# Altium project Common_HVSUP_ISOL_6W.PrjPCB (part 5 of 5)

## Sheet Supply_HV_ISOL.SchDoc: HVPSU_ISOL
size 420 x 297 mm; EDA_Number: ARTIQ; Projet: HVPSU_ISOL; Author: G.Kasprowicz; CompanyName: WUT ISE; DrawnBy: G.Kasprowicz; Organization: WUT ISE; Address1: PW ISE; Address2: Nowowiejska 15/19 00-665 Warsaw; Address3: gkasprow@gmail.com; DocumentNumber: 2; Revision: 1.0; SheetNumber: 2; SheetTotal: 4; ModifiedBy: -; CheckedDate: -; Title2: Supply HV ISOL; DivGrp: WUT ISE; Designer: G.Kasprowicz; ModifiedDate: -; ProjectName: Sensor Box
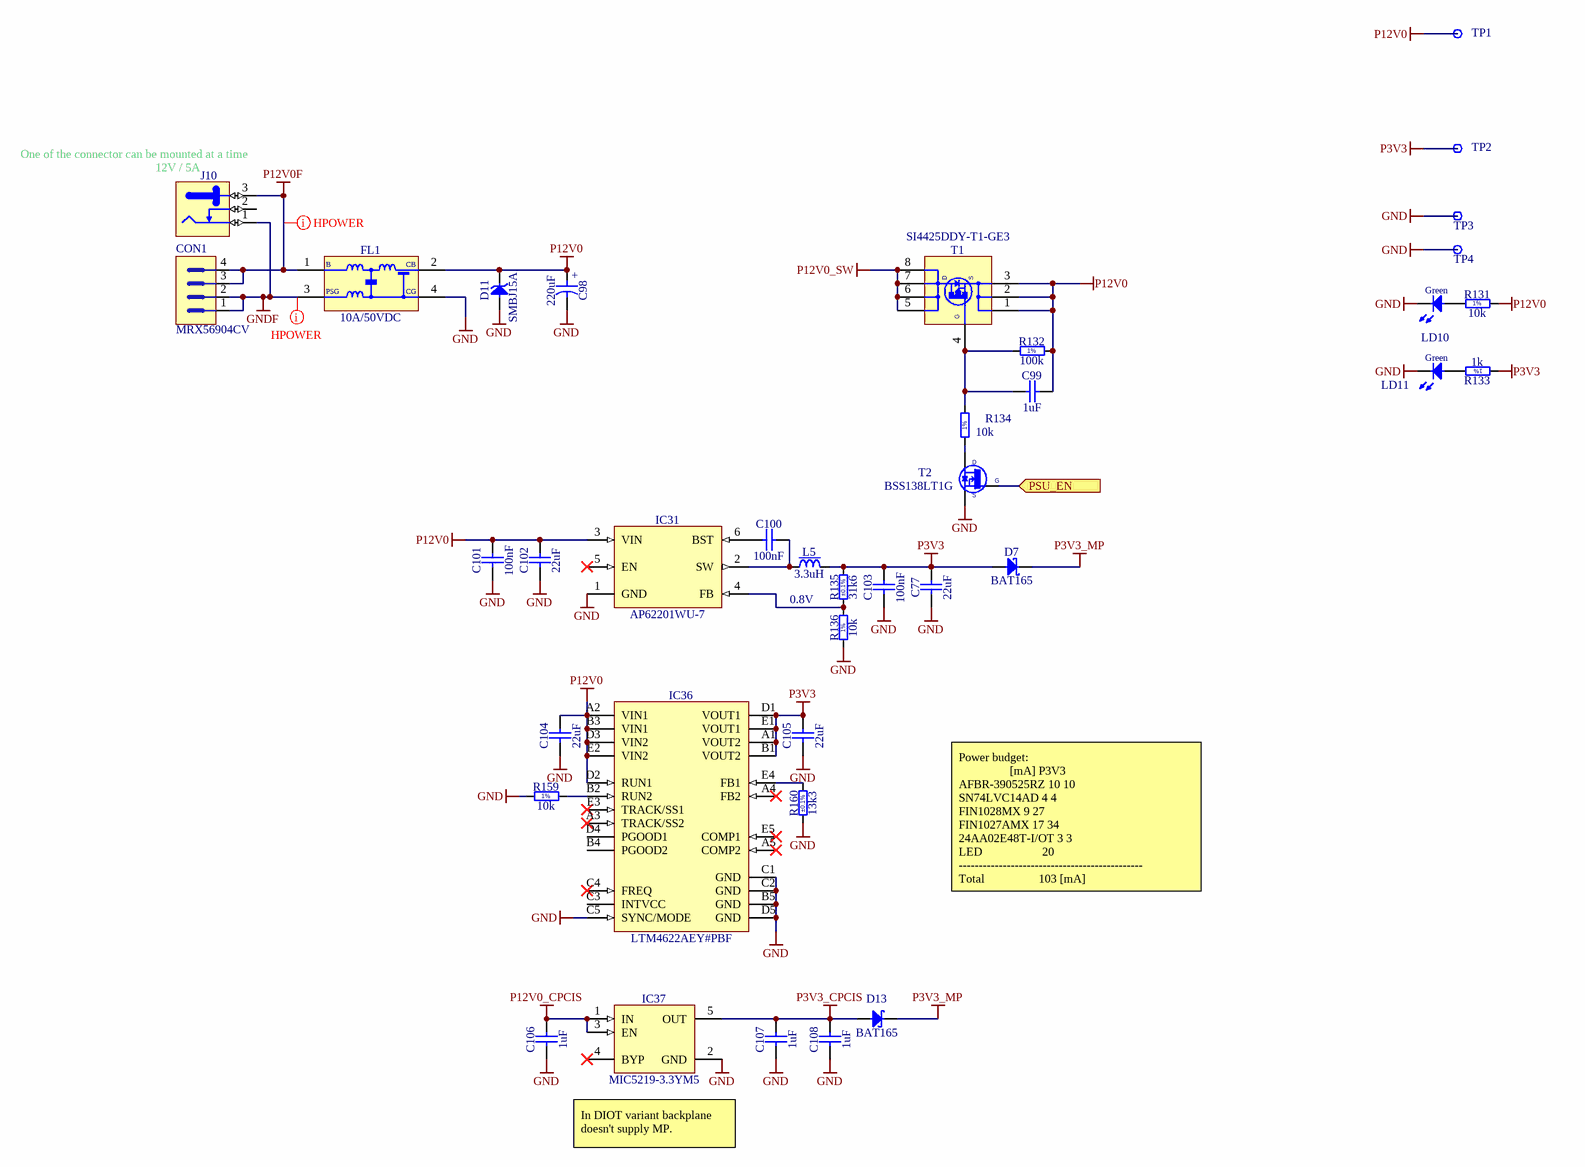
[diagram p9: Supply_HV_ISOL.SchDoc]

### Parts
C77  22uF  [CAPC2012X135N]
C98  220uF  [CAPAE830X620N]
C99  1uF  [CAPC1005X55N]
C100  100nF  [CAPC1005X55N]
C101  100nF  [CAPC1005X55N]
C102  22uF  [CAPC2012X135N]
C103  100nF  [CAPC1005X55N]
C104  22uF  [CAPC2012X135N]
C105  22uF  [CAPC2012X135N]
C106  1uF  [CAPC1608X87N]
C107  1uF  [CAPC1005X55N]
C108  1uF  [CAPC1005X55N]
CON1  MRX56904CV  [MRX56904CV]
D7  BAT165  [SOD2512X110N]
D11  SMBJ15A  [DIOM5336X265N]
D13  BAT165  [SOD2512X110N]
FL1  10A/50VDC  [FIL_MURATA_BNX02]
IC31  AP62201WU-7  [SOT95P280X100-6N]
IC36  LTM4622AEY#PBF  [BGA25C127P5X5_625X625X262]
IC37  MIC5219-3.3YM5  [SOT95P280X145-5N]
J10  Jack  [SWITCHCRAFT_L712RA]  (value not drawn)
L5  3.3uH  [IND_WURTH_WE-TPC_4828]
LD10  Green  [LED_KINGBRIGHT_KPH-1608CGCK]
LD11  Green  [LED_KINGBRIGHT_KPH-1608CGCK]
R131  10k  [RESC1005X40N]
R132  100k  [RESC1608X55N]
R133  1k  [RESC1608X55N]
R134  10k  [RESC1005X40N]
R135  31k6  Tolerance: ±0.1%  [RESC1005X35N]
R136  10k  [RESC1005X40N]
R159  10k  [RESC1005X40N]
R160  13k3  Tolerance: ±0.1%  [RESC1608X55N]
T1  SI4425DDY-T1-GE3  [SOIC127P600X175-8N]
T2  BSS138LT1G  [SOT95P240X110-3N]
TP1  Test Point  [TPS127]  (value not drawn)  (no BOM)
TP2  Test Point  [TPS127]  (value not drawn)  (no BOM)
TP3  Test Point  [TPS127]  (value not drawn)  (no BOM)
TP4  Test Point  [TPS127]  (value not drawn)  (no BOM)

### Ports
PSU_EN (in)

### Nets
GND: C77.1 C98.2 C101.1 C102.1 C103.1 C104.1 C105.1 C106.1 C107.1 C108.1 D11.2(A) FL1.4(CG) IC31.1(GND) IC36.B5(GND) IC36.C1(GND) IC36.C2(GND) IC36.C5(SYNC/MODE) IC36.D5(GND) IC37.2(GND) LD10.1(C) LD11.1(C) R136.1 R159.1 R160.1 T2.2(S) TP3.1 TP4.1
GNDF: CON1.1 CON1.2 FL1.3(PSG) J10.1
P3V3: C77.2 C103.2 C105.2 D7.2(A) IC36.A1(VOUT2) IC36.B1(VOUT2) IC36.D1(VOUT1) IC36.E1(VOUT1) L5.2 R133.1 R135.2 TP2.1
P3V3_CPCIS: C107.2 C108.2 D13.2(A) IC37.5(OUT)
P3V3_MP: D7.1(C) D13.1(C)
P12V0: C98.1 C99.2 C101.2 C102.2 C104.2 D11.1(C) FL1.2(CB) IC31.3(VIN) IC36.A2(VIN1) IC36.B3(VIN1) IC36.D2(RUN1) IC36.D3(VIN2) IC36.E2(VIN2) R131.2 R132.2 T1.1(S) T1.2(S) T1.3(S) TP1.1
P12V0_CPCIS: C106.2 IC37.1(IN) IC37.3(EN)
P12V0_SW: T1.5(D) T1.6(D) T1.7(D) T1.8(D)
P12V0F: CON1.3 CON1.4 FL1.1(B) J10.3
PSU_EN: T2.1(G) ; port PSU_EN
NetC99_1: C99.1 R132.1 R134.2 T1.4(S)
NetC100_1: C100.1 IC31.6(BST)
NetC100_2: C100.2 IC31.2(SW) L5.1
NetIC31_4: IC31.4(FB) R135.1 R136.2
NetIC36_B2: IC36.B2(RUN2) R159.2
NetIC36_E4: IC36.E4(FB1) R160.2
NetLD10_2: LD10.2(A) R131.1
NetLD11_2: LD11.2(A) R133.2
NetR134_1: R134.1 T2.3(D)

Not connected (* = marked no-connect by the designer): IC31 5(EN)*; IC36 A3(TRACK/SS2)* A4(FB2)* A5(COMP2)* B4(PGOOD2) C3(INTVCC) C4(FREQ)* D4(PGOOD1) E3(TRACK/SS1)* E5(COMP1)*; IC37 4(BYP)*; J10 2

### Layout directives
net class Hpower; rule Routing Via Style [Pref Size = 0.7mm    Pref Hole Size = 0.5mm]; rule Width Constraint [Pref Width = 20mil    Min Width = 15mil    Max Width = 50mil]: GNDF, P12V0F

### Notes on the sheet
- (near J10) One of the connector can be mounted at a time
- (near J10) 12V / 5A
- 0.8V
- Power budget:
  [mA]	P3V3
  AFBR-390525RZ	10	10
  SN74LVC14AD	4	4
  FIN1028MX	9	27
  FIN1027AMX	17	34
  24AA02E48T-I/OT	3	3
  LED		                  20
  ----------------------------------------------
  Total		                103 [mA]
- In DIOT variant backplane doesn't supply MP.
- Project/Equipment
- Document
- Designer
- Drawn by
- Check.by
- Copyright WUT ISE 2020.
  This documentation describes Open Hardware and is licensed under the CERN OHL v.1.2. You may redistribute and modify this documentation under the terms of the CERN OHL v.1.2. (http://ohwr.org/CERNOHL). This documentation is distributed WITHOUT ANY EXPRESS OR IMPLIED WARRANTY, INCLUDING OF MERCHANTABILITY, SATISFACTORY QUALITY AND FITNESS FOR A PARTICULAR PURPOSE. Please see the CERN OHL v.1.2 for applicable conditions.
- Contact
- File
- Last Mod.
- Print Date
- Sheet
- Size
- A3
- of
- Rev
- (in symbol CAE830-620_220UF_16V_20%) +
- (in symbol R0402_10K_1%_0.0625W_100PPM) 1%
- (in symbol R0603_1K_1%_0.1W_100PPM) 1%
- (in symbol R0603_100K_1%_0.1W_100PPM) 1%
- (in symbol SI4425DDY-T1-GE3) G

### Library data of the parts
C77 C102 C104 C105 = CC0805_22UF_16V_10%_X5R: Non-polarised capacitor; Part Description: SMD Multilayer Chip Ceramic Capacitor; Manufacturer: GENERIC; Manufacturer1 Part Number: C2012X5R1C226KT; Voltage: 16V; TC: X5R; Tolerance: ±10%; Part Number: CC0805_22UF_16V_10%_X5R; Component Kind: Standard; Component Type: Standard; Pin Count: 2; Value: 22uF; Status: Preferred; Manufacturer Part Number: CC0805_22UF_16V_10%_X5R; Case: 0805; Mounted: Yes; Socket: No; SMD: Yes; Sense: No; Manufacturer1 Example: TDK; Manufacturer1 ComponentHeight: 1.35mm; HelpURL: \\cern.ch\dfs\Applications\Altium\Datasheets\CC0805_X5R_TDK_C.pdf; Author: CERN DEM JLC; CreateDate: 25.10.2012; LatestRevisionDate: 25.10.2012
C98 = CAE830-620_220UF_16V_20%: Polarised capacitor; Part Description: Aluminum Electrolytic SMT Capacitor; Manufacturer: PANASONIC; Manufacturer Part Number: EEEFK1C221AP; Voltage: 16V; Tolerance: ±20%; Part Number: CAE830-620_220UF_16V_20%; Component Kind: Standard; Component Type: Standard; Pin Count: 2; Value: 220uF; Status: Not Recommended; Case: E; Mounted: Yes; Socket: No; SMD: Yes; Sense: No; ComponentHeight: 6.2mm; HelpURL: \\cern.ch\dfs\Applications\Altium\Datasheets\CAE_PANASONIC_FK.pdf; Author: CERN DEM JLC; CreateDate: 03.12.2007; LatestRevisionDate: 05.11.2014
C99 C107 C108 = CC0402_1UF_16V_10%_X5R: Non-polarised capacitor; Part Description: SMD Multilayer Chip Ceramic Capacitor; Manufacturer: GENERIC; Manufacturer1 Part Number: C1005X5R1C105KT; Voltage: 16V; TC: X5R; Tolerance: ±10%; Part Number: CC0402_1UF_16V_10%_X5R; Component Kind: Standard; Component Type: Standard; Pin Count: 2; Value: 1uF; Status: Preferred; Manufacturer Part Number: CC0402_1UF_16V_10%_X5R; Case: 0402; Mounted: Yes; Socket: No; SMD: Yes; Sense: No; Manufacturer1 Example: TDK; Manufacturer1 ComponentHeight: 0.55mm; HelpURL: \\cern.ch\dfs\Applications\Altium\Datasheets\CC0402_X5R_TDK_C.pdf; Author: CERN DEM JLC
  C99: CreateDate: 2012-10-25; LatestRevisionDate: 2012-10-25
  C107 C108: CreateDate: 25.10.2012; LatestRevisionDate: 25.10.2012
C100 C101 C103 = CC0402_100NF_16V_10%_X5R: Non-polarised capacitor; Part Description: SMD Multilayer Chip Ceramic Capacitor; Manufacturer: GENERIC; Manufacturer1 Part Number: GRM155R61C104KA88D; Voltage: 16V; TC: X5R; Tolerance: ±10%; Part Number: CC0402_100NF_16V_10%_X5R; Component Kind: Standard; Component Type: Standard; Pin Count: 2; Value: 100nF; Status: None; Manufacturer Part Number: CC0402_100NF_16V_10%_X5R; Case: 0402; Mounted: Yes; Socket: No; SMD: Yes; Sense: No; Manufacturer1 Example: MURATA; Manufacturer1 ComponentHeight: 0.55mm; HelpURL: \\cern.ch\dfs\Applications\Altium\Datasheets\CC0402_X5R_MURATA_GRM.pdf; Author: CERN DEM JLC; CreateDate: 10.12.2013; LatestRevisionDate: 10.12.2013
C106 = CC0603_1UF_25V_10%_X7R: Non-polarised capacitor; Part Description: SMD Multilayer Chip Ceramic Capacitor; Manufacturer: GENERIC; Manufacturer1 Part Number: GRM188R71E105KA12D; Voltage: 25V; TC: X7R; Tolerance: ±10%; Part Number: CC0603_1UF_25V_10%_X7R; Component Kind: Standard; Component Type: Standard; Pin Count: 2; Value: 1uF; Status: None; Manufacturer Part Number: CC0603_1UF_25V_10%_X7R; Case: 0603; Mounted: Yes; Socket: No; SMD: Yes; Sense: No; Manufacturer1 Example: MURATA; Manufacturer1 ComponentHeight: 0.9mm; HelpURL: \\cern.ch\dfs\Applications\Altium\Datasheets\CC0603_X7R_MURATA.pdf; Author: CERN DEM JLC; CreateDate: 18.01.2011; LatestRevisionDate: 18.01.2011
CON1 = CON_CRIMP_4.2mm_RA_4: 4.2mm cripm terminal header
D7 = BAT165: Schottky Diode; Part Description: Medium Power AF Schottky Diode; Manufacturer: INFINEON; Voltage: 40V; Power: 750mA; PressFit: No; Bonding: No; Part Number: BAT165; Component Kind: Standard; Component Type: Standard; Device: BAT165; PackageDescription: Small Outline Diode (SOD-323), 1.70mm W X 1.25mm L X 1.10mm H body,  IPC Medium Density; Manufacturer Part Number: BAT165; Pin Count: 2; Case: SOD-323; Mounted: Yes; Socket: No; SMD: Yes; Sense: No; ComponentHeight: 1.1mm; HelpURL: \\cern.ch\dfs\Applications\Altium\Datasheets\BAT165.pdf; Author: CERN DEM JLC; CreateDate: 12.11.2014; LatestRevisionDate: 12.11.2014
D11 = SMBJ15A: Zener Diode; Part Description: Uni-Directional Transient Voltage Suppressor Diode; Manufacturer: FAIRCHILD SEMICONDUCTOR; Voltage: 15V; Power: 600W; PressFit: No; Bonding: No; Part Number: SMBJ15A; Component Kind: Standard; Component Type: Standard; Device: SMBJ15A; PackageDescription: DO-214-AA/SMB Diode, Molded Body; 5.34mm L X 3.625mm W X 2.65mm H, IPC Medium Density; Manufacturer Part Number: SMBJ15A; Pin Count: 2; Case: DO-214AA; Mounted: Yes; Socket: No; SMD: Yes; Sense: No; ComponentHeight: 2.65mm; HelpURL: \\cern.ch\dfs\Applications\Altium\Datasheets\SMBJ.pdf; Author: CERN DEM JLC; CreateDate: 08.12.2008; LatestRevisionDate: 19.12.2011
D13 = BAT165: Schottky Diode; Manufacturer: INFINEON; Part Description: Medium Power AF Schottky Diode; Voltage: 40V; Power: 750mA; PressFit: No; Bonding: No; Manufacturer Part Number: BAT165; PackageDescription: Small Outline Diode (SOD-323), 1.70mm W X 1.25mm L X 1.10mm H body,  IPC Medium Density; Part Number: BAT165; Component Kind: Standard; Component Type: Standard; Device: BAT165; Pin Count: 2; Case: SOD323; Mounted: Yes; Socket: No; SMD: Yes; Sense: No; ComponentHeight: 1.1mm; HelpURL: \\cern.ch\dfs\Applications\Altium\Datasheets\BAT165.pdf; Author: CERN DEM JLC; CreateDate: 12.11.2014; LatestRevisionDate: 12.11.2014
FL1 = FIL_MURATA_BNX022-01L: Block Type EMIFIL (LC Combined); Part Description: Block Type EMIFIL (LC Combined) SMD Type, BNX02* Series; Manufacturer: MURATA; Resistance: 0.5R; Part Number: FIL_MURATA_BNX022-01L; Component Kind: Standard; Component Type: Standard; Pin Count: 2; Value: 10A/50VDC; Status: None; Manufacturer Part Number: BNX022-01L; Mounted: Yes; Socket: No; SMD: Yes; Sense: No; ComponentHeight: 3.3mm; HelpURL: \\cern.ch\dfs\Applications\Altium\Datasheets\FIL_MURATA_BNX022-01L.pdf; Author: CERN DEM JLC; CreateDate: 10.10.2012; LatestRevisionDate: 10.10.2012
IC31 = AP62201WU-7: 4.2V TO 18V INPUT, 2A LOW IQ SYNCHRONOUS BUCK CONVERTER; Manufacturer: DIODES INCORPORATED; PressFit: No; Bonding: No; Part Number: AP62201WU-7; Component Kind: Standard; Component Type: Standard; Device: AP62201WU-7; PackageDescription: SOT23, 0.95mm Pitch; 6 Pin, 1.625mm W X 2.90mm L X 1.00mm H body, IPC Medium Density; Part Description: 4.2V TO 18V INPUT, 2A LOW IQ SYNCHRONOUS BUCK CONVERTER; Manufacturer Part Number: AP62201WU-7; Pin Count: 6; Case: SOT23-6; Mounted: Yes; Socket: No; SMD: Yes; Sense: No; ComponentHeight: 1.1mm; HelpURL: \\cern.ch\dfs\Applications\Altium\Datasheets\AP6220x.pdf; Author: CERN DEM HF; CreateDate: 07.01.2022; LatestRevisionDate: 07.01.2022
IC36 = LTM4622AEY#PBF: 3.6V-20V To 1.5V-12V, Dual 2A or Single 4A  Ultrathin Step-Down DC/DC µModule Regulator; Part Description: 3.6V-20V To 1.5V-12V, Dual 2A or Single 4A  Ultrathin Step-Down DC/DC uModule Regulator; Manufacturer: LINEAR TECHNOLOGY; PressFit: No; Bonding: No; Part Number: LTM4622AEY#PBF; Component Kind: Standard; Component Type: Standard; Device: LTM4622AEY#PBF; PackageDescription: BGA, 1.27mm Pitch, Square; 25 Pin, 5 Columns X 5 Rows, 6.25mm X 6.25mm X 2.62mm H; Manufacturer Part Number: LTM4622AEY#PBF; Pin Count: 25; Case: BGA25; Mounted: Yes; Socket: No; SMD: Yes; Sense: No; ComponentHeight: 2.62mm; HelpURL: \\cern.ch\dfs\Applications\Altium\Datasheets\LTM4622AEY#PBF.pdf; Author: CERN DEM MR; CreateDate: 29.09.2017; LatestRevisionDate: 29.09.2017
IC37 = MIC5219-3.3YM5: 500mA Peak Output LDO Regulator; Part Description: 3.3V 500mA Peak Output Low Drop-Out  (LDO) Regulator; Manufacturer: MICROCHIP TECHNOLOGY; PressFit: No; Bonding: No; Part Number: MIC5219-3.3YM5; Component Kind: Standard; Component Type: Standard; Device: MIC5219-3.3YM5; PackageDescription: SOT, 0.95mm pitch; 5 pin, 1.60mm W X 2.90mm L X 1.45mm H body, IPC Medium Density; Manufacturer Part Number: MIC5219-3.3YM5; Pin Count: 5; Case: SOT23-5; Mounted: Yes; Socket: No; SMD: Yes; Sense: No; ComponentHeight: 1.45mm; HelpURL: \\cern.ch\dfs\Applications\Altium\Datasheets\MIC5219-3.3YM5.pdf; Author: CERN DEM WB; CreateDate: 2019-04-16; LatestRevisionDate: 2019-04-16
J10 = CON_DC_5A_THT_RA: 24V /3. 5A, 2.1mm Diameter Pin, SMD DC Power Supply Connector With  Break Contact; Part Description: 12V/5A, 2.5mm Diameter Pin, THT DC Power Supply Connector With  Break Contact; Manufacturer: SWITCHCRAFT; Manufacturer Part Number: L712RA; PressFit: No; Part Number: SWITCHCRAFT_L712RA; Component Kind: Standard; Component Type: Standard; Pin Count: 3; Family: Jack; Mounted: Yes; Socket: No; SMD: No; Sense: No; Status: None; ComponentHeight: 11mm; HelpURL: \\cern.ch\dfs\Applications\Altium\Datasheets\LUMBERG_161314.pdf; Author: GK; CreateDate: 15.02.2011; LatestRevisionDate: 20.07.2011
L5 = IND_3.3UH_30%_WURTH_WE-TPC_744043003: Inductor With Core; Part Description: Shielded Tiny Power Inductor (WE-TPC Serie); Manufacturer: WURTH ELEKTRONIK; Power: 2.15A; Resistance: 0.03R; Tolerance: ±30%; Part Number: IND_3.3UH_30%_WURTH_WE-TPC_744043003; Component Kind: Standard; Component Type: Standard; Pin Count: 2; Value: 3.3uH; Manufacturer Part Number: 744043003; Mounted: Yes; Socket: No; SMD: Yes; Sense: No; ComponentHeight: 3mm; HelpURL: \\cern.ch\dfs\Applications\Altium\Datasheets\IND_WURTH_WE-TPC_744043003.pdf; Author: CERN DEM JLC; CreateDate: 12.07.2011; LatestRevisionDate: 24.01.2012
LD10 LD11 = LED_KINGBRIGHT_KPH-1608CGCK: LED Green 1C 2A; Part Description: SMD Green LED, Case 1.6mmX0.8mm(0603), 0.65mm Thickness; PressFit: No; Bonding: No; Part Number: LED_KINGBRIGHT_KPH-1608CGCK; Component Kind: Standard; Component Type: Standard; Color: Green; PackageDescription: SMT Green LED, Case 0603, Body L 1.6 x W 0.8mm H 0.65mm; Manufacturer: KINGBRIGHT; Manufacturer Part Number: KPH-1608CGCK; Pin Count: 2; Mounted: Yes; Socket: No; SMD: Yes; Sense: No; ComponentHeight: 0.65mm; HelpURL: \\cern.ch\dfs\Applications\Altium\Datasheets\LED_KINGBRIGHT_KPH-1608CGCK.pdf; Author: CERN DEM JLC; CreateDate: 03/07/2017; LatestRevisionDate: 03/07/2017
R131 = R0402_10K_1%_0.0625W_100PPM: Resistor - 1%; Part Description: General Purpose Thick Film Chip Resistor; Manufacturer: GENERIC; Manufacturer1 Part Number: 232270671003L; TC: ±100ppm/°C; PressFit: No; Part Number: R0402_10K_1%_0.0625W_100PPM; Component Kind: Standard; Component Type: Standard; Pin Count: 2; Value: 10k; Status: Not Recommended; Power: 0.0625W; Tolerance: ±1%; Manufacturer Part Number: R0402_10K_1%_0.0625W_100PPM; Case: 0402; Mounted: Yes; Sense: No; Socket: No; SMD: Yes; Manufacturer1 Example: YAGEO PHYCOMP; Manufacturer1 ComponentHeight: 0.4mm; HelpURL: \\cern.ch\dfs\Applications\Altium\Datasheets\R0402_Phycomp_RC0402.pdf; Author: CERN DEM JLC; CreateDate: 03.12.2007; LatestRevisionDate: 17.10.2012
R132 = R0603_100K_1%_0.1W_100PPM: Resistor - 1%; Part Description: General Purpose Thick Film Chip Resistor; Manufacturer: GENERIC; Manufacturer1 Part Number: NRC06F1003TRF; Power: 0.1W; TC: ±100ppm/°C; Part Number: R0603_100K_1%_0.1W_100PPM; Component Kind: Standard; Component Type: Standard; Pin Count: 2; Value: 100k; Status: Preferred; Tolerance: ±1%; Manufacturer Part Number: R0603_100K_1%_0.1W_100PPM; Case: 0603; Mounted: Yes; Sense: No; Socket: No; SMD: Yes; Manufacturer1 Example: NIC COMPONENT; Manufacturer1 ComponentHeight: 0.55mm; HelpURL: \\cern.ch\dfs\Applications\Altium\Datasheets\R0603_NIC_NRC.pdf; Author: CERN DEM JLC; CreateDate: 2007-12-03; LatestRevisionDate: 2008-03-13
R133 = R0603_1K_1%_0.1W_100PPM: Resistor - 1%; Part Description: General Purpose Thick Film Chip Resistor; Manufacturer: GENERIC; Manufacturer1 Part Number: NRC06F1001TRF; Power: 0.1W; TC: ±100ppm/°C; PressFit: No; Part Number: R0603_1K_1%_0.1W_100PPM; Component Kind: Standard; Component Type: Standard; Pin Count: 2; Value: 1k; Status: Preferred; Tolerance: ±1%; Manufacturer Part Number: R0603_1K_1%_0.1W_100PPM; Case: 0603; Mounted: Yes; Sense: No; Socket: No; SMD: Yes; Manufacturer1 Example: NIC COMPONENT; Manufacturer1 ComponentHeight: 0.55mm; HelpURL: \\cern.ch\dfs\Applications\Altium\Datasheets\R0603_NIC_NRC.pdf; Author: CERN DEM JLC; CreateDate: 03.12.2007; LatestRevisionDate: 13.03.2008
R134 R136 R159 = R0402_10K_1%_0.0625W_100PPM: as R108 on sheet LED_indicators_6W; Part Number: R0402_10K_1%_0.0625W_100PPM; Component Kind: Standard; Component Type: Standard; Pin Count: 2; Value: 10k; Status: Not recommended; Power: 0.0625W; Tolerance: ±1%; Manufacturer Part Number: R0402_10K_1%_0.0625W_100PPM; Case: 0402; Mounted: Yes; Sense: No; Socket: No; SMD: Yes; Manufacturer1 Example: YAGEO PHYCOMP; Manufacturer1 ComponentHeight: 0.4mm; HelpURL: \\cern.ch\dfs\Applications\Altium\Datasheets\R0402_Phycomp_RC0402.pdf; Author: CERN DEM JLC
  R134: CreateDate: 2007-12-03; LatestRevisionDate: 2012-10-17
  R136 R159: CreateDate: 03.12.2007; LatestRevisionDate: 17.10.2012
R135 = R0402_31K6_0.1%_0.063W_25PPM_YAGEO_RT: Resistor - 0.1%; Part Description: Thin Film Chip Resistor; Manufacturer: YAGEO; Manufacturer Part Number: RT0402BRD0731K6L; Power: 0.063W; TC: ±25ppm/°C; Voltage: 50V; PressFit: No; Part Number: R0402_31K6_0.1%_0.063W_25PPM_YAGEO_RT; Component Kind: Standard; Component Type: Standard; Pin Count: 2; Value: 31k6; Status: Not Recommended; Case: 0402; Mounted: Yes; Sense: No; Socket: No; SMD: Yes; ComponentHeight: 0.35mm; HelpURL: \\cern.ch\dfs\Applications\Altium\Datasheets\R0402_YAGEO_RT.pdf; Author: CERN DEM BC; CreateDate: 30.07.2020; LatestRevisionDate: 30.07.2020
R160 = R0603_13K3_0.1%_0.063W_10PPM: Resistor - 0.1%; Part Description: Thin Film Chip Resistor; Manufacturer: GENERIC; Manufacturer1 Part Number: RN73C1J13K3BTDF; Power: 0.063W; TC: ±10ppm; PressFit: No; Part Number: R0603_13K3_0.1%_0.063W_10PPM; Component Kind: Standard; Component Type: Standard; Pin Count: 2; Value: 13k3; Status: Not Recommended; Manufacturer Part Number: R0603_13K3_0.1%_0.063W_10PPM; Case: 0603; Mounted: Yes; Sense: No; Socket: No; SMD: Yes; Manufacturer1 Example: TYCO HOLSWORTHY; Manufacturer1 ComponentHeight: 0.5mm; HelpURL: \\cern.ch\dfs\Applications\Altium\Datasheets\R0603_Tyco_RN73.pdf; Author: CERN DEM JLC; CreateDate: 03.12.2007; LatestRevisionDate: 13.03.2008
T1 = SI4425DDY-T1-GE3: -30V -19.7A P-Channel MOSFET; Manufacturer: VISHAY SILICONIX; PressFit: No; Bonding: No; Part Number: SI4425DDY-T1-GE3; Component Kind: Standard; Component Type: Standard; Device: SI4425DDY-T1-GE3; PackageDescription: SOIC 8, Pitch 1.27mm - Body 4x5mm, IPC Medium Density; Part Description: -30V -19.7A P-Channel MOSFET; Manufacturer Part Number: SI4425DDY-T1-GE3; Pin Count: 8; Case: SOIC8; Mounted: Yes; Socket: No; SMD: Yes; Sense: No; ComponentHeight: 1.75mm; HelpURL: \\cern.ch\dfs\Applications\Altium\Datasheets\SI4425DDY-T1-GE3.pdf; Author: CERN DEM MR; CreateDate: 05/10/2016; LatestRevisionDate: 05/10/2016
T2 = BSS138LT1G: N-CHANNEL MOSFET WITH DIODE; Part Description: 50V 200mA N-Channel Enhancement Mode Field-Effect Transistor; Manufacturer: ON SEMICONDUCTOR; PressFit: No; Bonding: No; Part Number: BSS138LT1G; Component Kind: Standard; Component Type: Standard; Device: BSS138LT1G; PackageDescription: SOT23 3-Leads, Pitch 0.95mm - Body 1.4x3mm, IPC Medium Density; Manufacturer Part Number: BSS138LT1G; Pin Count: 3; Case: SOT23-3; Mounted: Yes; Socket: No; SMD: Yes; Sense: No; ComponentHeight: 1.11mm; HelpURL: \\cern.ch\dfs\Applications\Altium\Datasheets\BSS138LT1G.pdf; Author: CERN DEM JLC; CreateDate: 23.03.2009; LatestRevisionDate: 23.03.2009
TP1-TP4 = SMD_PAD_1.27X1.27MM: Part Description: 1.27mm x 1.27mm PCB Copper Area (SMD Test Point); Mounted: No; Part Number: SMD_PAD_1.27X1.27MM; Component Type: Standard (No BOM); Pin Count: 1; Family: Test Point; Socket: No; SMD: Yes; Sense: No; Status: None; ComponentHeight: 0mm; HelpURL: Undefined; Author: CERN DEM JLC; CreateDate: 12.01.2008; LatestRevisionDate: 12.01.2008; PackageDescription: 1.27mm x 1.27mm PCB Copper Area (SMD Test Point)

## Sheet DIOT_Connectors.SchDoc: HVPSU_ISOL
size 420 x 297 mm; Project: HVPSU_ISOL.PrjPCB; Author: G.Kasprowicz; CompanyName: WUT ISE; DrawnBy: G.Kasprowicz; Organization: WUT ISE; Address1: PW ISE; Address2: Nowowiejska 15/19 00-665 Warsaw; Address3: gkasprow@gmail.com; DocumentNumber: 4; Revision: 1; SheetNumber: 4; SheetTotal: 4; ModifiedBy: -; CheckedDate: -; Title2: DIOT Connectors; DivGrp: WUT ISE; Designer: G.Kasprowicz; ModifiedDate: -; ProjectName: Sensor Box
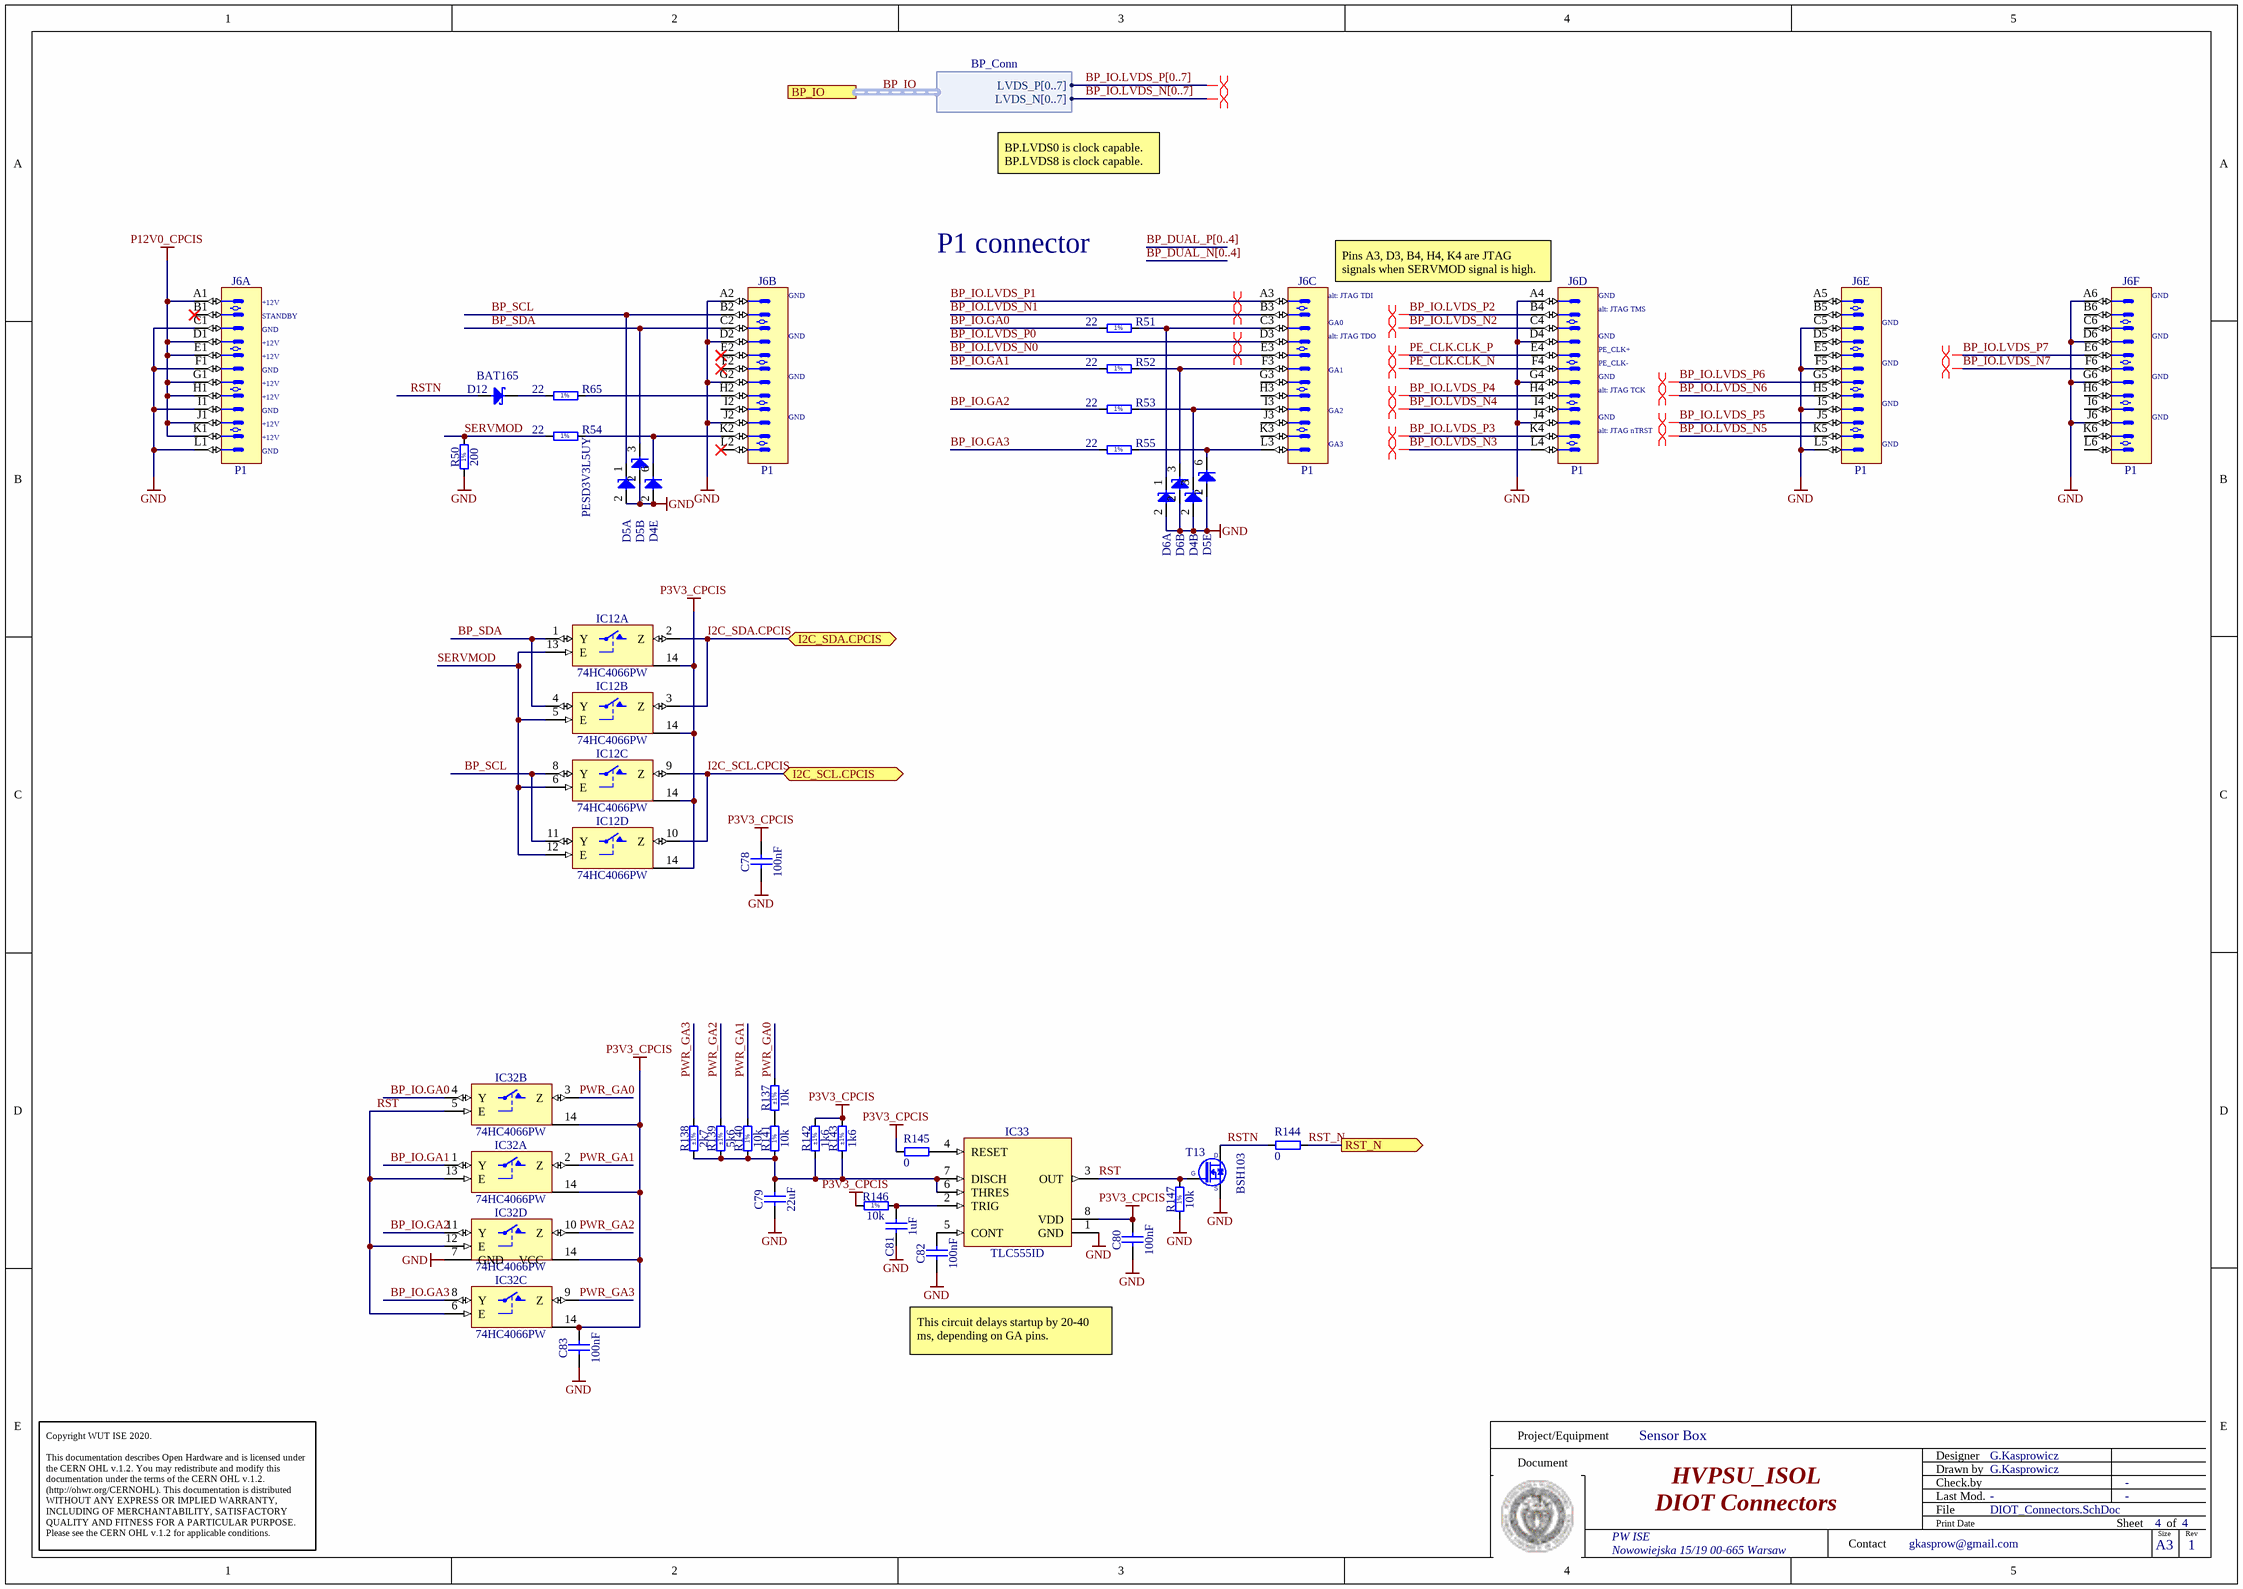
[diagram p10: DIOT_Connectors.SchDoc]

### Parts
C78  100nF  [CAPC1005X55N]
C79  22uF  [CAPC1608X90N]
C80  100nF  [CAPC1005X55N]
C81  1uF  [CAPC1005X55N]
C82  100nF  [CAPC1005X55N]
C83  100nF  [CAPC1005X55N]
D4  PESD3V3L5UY  [SOT65P210X110-6N]  (value not drawn)  (parts B,E of 5)
D5  PESD3V3L5UY  [SOT65P210X110-6N]  (value not drawn)  (parts A,B,E of 5)
D6  PESD3V3L5UY  [SOT65P210X110-6N]  (value not drawn)  (parts A,B of 5)
D12  BAT165  [SOD2512X110N]
IC12  74HC4066PW  [SOP65P640X110-14N]  (parts A,B,C,D of 4)
IC32  74HC4066PW  [SOP65P640X110-14N]  (parts A,B,C,D of 4)
IC33  TLC555ID  [SOIC127P600X175-8N]
J6  P1  [AMPHENOL_10052825-101LF]  (parts A,B,C,D,E,F of 6)
R50  200  [RESC1005X40N]
R51  22  [RESC1005X40N]
R52  22  [RESC1005X40N]
R53  22  [RESC1005X40N]
R54  22  [RESC1005X40N]
R55  22  [RESC1005X40N]
R65  22  [RESC1005X40N]
R137  10k  Tolerance: ±1%  [RESC1005X40N]
R138  2k7  Tolerance: ±1%  [RESC1608X55N]
R139  5k6  Tolerance: ±1%  [RESC1005X40N]
R140  10k  [RESC1005X40N]
R141  10k  [RESC1005X40N]
R142  1k6  Tolerance: ±1%  [RESC1005X40N]
R143  1k6  Tolerance: ±1%  [RESC1005X40N]
R144  0  [RESC1005X40N]
R145  0  [RESC1005X40N]
R146  10k  [RESC1005X40N]
R147  10k  [RESC1005X40N]
T13  BSH103  [SOT95P230X110-3N]

### Ports
BP_IO (harness BP_Conn), I2C_SCL.CPCIS (bidir), I2C_SDA.CPCIS (bidir), RST_N (out)

### Harnesses
BP_Conn: LVDS_P[0..7], LVDS_N[0..7]

### Nets
GND: C78.1 C79.1 C80.1 C81.1 C82.1 C83.1 D4.2(A) D5.2(A) D6.2(A) IC12.7(GND) IC32.7(GND) IC33.1(GND) J6.A2 J6.A4 J6.A6 J6.C1 J6.C5 J6.D2 J6.D4 J6.D6 J6.F1 J6.F5 J6.G2 J6.G4 J6.G6 J6.I1 J6.I5 J6.J2 J6.J4 J6.J6 J6.L1 J6.L5 R50.1 R147.1 T13.2(S)
P3V3_CPCIS: C78.2 C80.2 C83.2 IC12.14(VCC) IC32.14(VCC) IC33.8(VDD) R142.2 R143.2 R145.2 R146.1
P12V0_CPCIS: J6.A1 J6.D1 J6.E1 J6.G1 J6.H1 J6.J1 J6.K1
BP_IO.GA0: IC32.4(Y) R51.1
BP_IO.GA1: IC32.1(Y) R52.1
BP_IO.GA2: IC32.11(Y) R53.1
BP_IO.GA3: IC32.8(Y) R55.1
BP_IO.LVDS_N0: J6.E3
BP_IO.LVDS_N1: J6.B3
BP_IO.LVDS_N2: J6.C4
BP_IO.LVDS_N3: J6.L4
BP_IO.LVDS_N4: J6.I4
BP_IO.LVDS_N5: J6.K5
BP_IO.LVDS_N6: J6.H5
BP_IO.LVDS_N7: J6.F6
BP_IO.LVDS_P0: J6.D3
BP_IO.LVDS_P1: J6.A3
BP_IO.LVDS_P2: J6.B4
BP_IO.LVDS_P3: J6.K4
BP_IO.LVDS_P4: J6.H4
BP_IO.LVDS_P5: J6.J5
BP_IO.LVDS_P6: J6.G5
BP_IO.LVDS_P7: J6.E6
BP_SCL: D5.1(C) IC12.8(Y) IC12.11(Y) J6.B2
BP_SDA: D5.3(C) IC12.1(Y) IC12.4(Y) J6.C2
I2C_SCL.CPCIS: IC12.9(Z) IC12.10(Z) ; port I2C_SCL.CPCIS
I2C_SDA.CPCIS: IC12.2(Z) IC12.3(Z) ; port I2C_SDA.CPCIS
PE_CLK.CLK_N: J6.F4
PE_CLK.CLK_P: J6.E4
PWR_GA0: IC32.3(Z) R137.2
PWR_GA1: IC32.2(Z) R140.2
PWR_GA2: IC32.10(Z) R139.2
PWR_GA3: IC32.9(Z) R138.2
RST: IC32.5(E) IC32.6(E) IC32.12(E) IC32.13(E) IC33.3(OUT) R147.2 T13.1(G)
RST_N: R144.1 ; port RST_N  [project net PSU_EN]
RSTN: D12.2(A) R144.2 T13.3(D)
SERVMOD: IC12.5(E) IC12.6(E) IC12.12(E) IC12.13(E) R50.2 R54.1
NetC79_2: C79.2 IC33.6(THRES) IC33.7(DISCH) R138.1 R139.1 R140.1 R141.1 R142.1 R143.1
NetC81_2: C81.2 IC33.2(TRIG) R146.2
NetC82_2: C82.2 IC33.5(CONT)
NetD4_3: D4.3(C) J6.I3 R53.2
NetD4_6: D4.6(C) J6.K2 R54.2
NetD5_6: D5.6(C) J6.L3 R55.2
NetD6_1: D6.1(C) J6.C3 R51.2
NetD6_3: D6.3(C) J6.F3 R52.2
NetD12_1: D12.1(C) R65.1
NetIC33_4: IC33.4(RESET) R145.1
NetJ6_H2: J6.H2 R65.2
NetR137_1: R137.1 R141.2

Not connected (* = marked no-connect by the designer): J6 A5 B1* B5 B6 C6 D5 E2* E5 F2* G3 H3 H6 I2 I6 J3 K3 K6 L2* L6

### Buses and harness runs
bus BP_DUAL_N[0..4]
bus BP_DUAL_P[0..4]
bus BP_IO.LVDS_N[0..7]
bus BP_IO.LVDS_P[0..7]
harness BP_IO = port BP_IO

### Layout directives
differential pair: (no net found under the mark), BP_IO.LVDS_N0, BP_IO.LVDS_N1, BP_IO.LVDS_N2, BP_IO.LVDS_N3, BP_IO.LVDS_N4, BP_IO.LVDS_N5, BP_IO.LVDS_N6, BP_IO.LVDS_N7, BP_IO.LVDS_P0, BP_IO.LVDS_P1, BP_IO.LVDS_P2, BP_IO.LVDS_P3, BP_IO.LVDS_P4, BP_IO.LVDS_P5, BP_IO.LVDS_P6, BP_IO.LVDS_P7, PE_CLK.CLK_N, PE_CLK.CLK_P

### Notes on the sheet
- BP.LVDS0 is clock capable.
  BP.LVDS8 is clock capable.
- P1 connector
- (near J6) +12V
- (near J6) STANDBY
- (near J6) GND
- (near J6) alt: JTAG TDI
- (near J6) GA0
- (near J6) Pins A3, D3, B4, H4, K4 are JTAG signals when SERVMOD signal is high.
- (near J6) alt: JTAG TMS
- (near J6) alt: JTAG TDO
- (near J6) GA1
- (near J6) alt: JTAG TCK
- (near J6) PE_CLK+
- (near J6) PE_CLK-
- (near J6) GA2
- (near J6) GA3
- (near J6) alt: JTAG nTRST
- This circuit delays startup by 20-40 ms, depending on GA pins.
- Project/Equipment
- Document
- Designer
- Drawn by
- Check.by
- Copyright WUT ISE 2020.
  This documentation describes Open Hardware and is licensed under the CERN OHL v.1.2. You may redistribute and modify this documentation under the terms of the CERN OHL v.1.2. (http://ohwr.org/CERNOHL). This documentation is distributed WITHOUT ANY EXPRESS OR IMPLIED WARRANTY, INCLUDING OF MERCHANTABILITY, SATISFACTORY QUALITY AND FITNESS FOR A PARTICULAR PURPOSE. Please see the CERN OHL v.1.2 for applicable conditions.
- Contact
- File
- Last Mod.
- Print Date
- Sheet
- Size
- A3
- of
- Rev
- (in symbol R0402_1k_1%_0.0625W_100PPM) 1%
- (in symbol R0402_10K_1%_0.0625W_100PPM) 1%
- (in symbol R0402_22R_1%_0.0625W_100PPM) 1%
- (in symbol R0402_200R_1%_0.0625W_100PPM) 1%

### Library data of the parts
C78 C80 C82 C83 = CC0402_100NF_16V_10%_X5R: as C100 on sheet Supply_HV_ISOL; Part Number: CC0402_100NF_16V_10%_X5R; Component Kind: Standard; Component Type: Standard; Pin Count: 2; Value: 100nF; Status: None; Manufacturer Part Number: CC0402_100NF_16V_10%_X5R; Case: 0402; Mounted: Yes; Socket: No; SMD: Yes; Sense: No; Manufacturer1 Example: MURATA; Manufacturer1 ComponentHeight: 0.55mm; HelpURL: \\cern.ch\dfs\Applications\Altium\Datasheets\CC0402_X5R_MURATA_GRM.pdf; Author: CERN DEM JLC; CreateDate: 10.12.2013; LatestRevisionDate: 10.12.2013
C79 = CC0603_22UF_6.3V_20%_X5R: Non-polarised capacitor; Manufacturer: GENERIC; Part Description: SMD Multilayer Chip Ceramic Capacitor; Manufacturer1 Part Number: C1608X5R0J226M080; Voltage: 6.3V; TC: X5R; Tolerance: ±20%; Part Number: CC0603_22UF_6.3V_20%_X5R; Component Kind: Standard; Component Type: Standard; Pin Count: 2; Value: 22uF; Status: None; Manufacturer Part Number: CC0603_22UF_6.3V_20%_X5R; Case: 0603; Mounted: Yes; Socket: No; SMD: Yes; Sense: No; Manufacturer1 Example: TDK; Manufacturer1 ComponentHeight: 0.9mm; HelpURL: \\cern.ch\dfs\Applications\Altium\Datasheets\CC0603_X5R_TDK_C.pdf; Author: CERN DEM JLC; CreateDate: 2013-12-16; LatestRevisionDate: 2020-12-03
C81 = CC0402_1UF_16V_10%_X5R: as C99 on sheet Supply_HV_ISOL; Part Number: CC0402_1UF_16V_10%_X5R; Component Kind: Standard; Component Type: Standard; Pin Count: 2; Value: 1uF; Status: Preferred; Manufacturer Part Number: CC0402_1UF_16V_10%_X5R; Case: 0402; Mounted: Yes; Socket: No; SMD: Yes; Sense: No; Manufacturer1 Example: TDK; Manufacturer1 ComponentHeight: 0.55mm; HelpURL: \\cern.ch\dfs\Applications\Altium\Datasheets\CC0402_X5R_TDK_C.pdf; Author: CERN DEM JLC; CreateDate: 2012-10-25; LatestRevisionDate: 2012-10-25
D4-D6 = PESD3V3L5UY: Fivefold ESD Protection Diode Arrays; Part Description: Fivefold ESD Protection Diode Arrays (30kV); Manufacturer: NEXPERIA; Voltage: 3.3V; Power: 200W; PressFit: No; Bonding: No; Part Number: PESD3V3L5UY; Component Kind: Standard; Component Type: Standard; Device: PESD3V3L5UY; PackageDescription: SOT363, SC-88, 0.65mm Pitch; 6 Pin, 1.25mm W X 2.00mm L X 1.10mm H body, IPC Medium Density; Manufacturer Part Number: PESD3V3L5UY; Pin Count: 6; Case: SOT363; Mounted: Yes; Socket: No; SMD: Yes; Sense: No; ComponentHeight: 1.1mm; HelpURL: \\cern.ch\dfs\Applications\Altium\Datasheets\PESD3V3L5UY.pdf; Author: CERN DEM WB; CreateDate: 05.07.2021; LatestRevisionDate: 05.07.2021
D12 = BAT165: as D13 on sheet Supply_HV_ISOL; Manufacturer Part Number: BAT165; PackageDescription: Small Outline Diode (SOD-323), 1.70mm W X 1.25mm L X 1.10mm H body,  IPC Medium Density; Part Number: BAT165; Component Kind: Standard; Component Type: Standard; Device: BAT165; Pin Count: 2; Case: SOD323; Mounted: Yes; Socket: No; SMD: Yes; Sense: No; ComponentHeight: 1.1mm; HelpURL: \\cern.ch\dfs\Applications\Altium\Datasheets\BAT165.pdf; Author: CERN DEM JLC; CreateDate: 12.11.2014; LatestRevisionDate: 12.11.2014
IC12 = 74HC4066PW: Part Description: Quad Single-Pole Single-Throw Analog Switch; Manufacturer: NXP SEMICONDUCTORS; PressFit: No; Bonding: No; Part Number: 74HC4066PW; Component Kind: Standard; Component Type: Standard; Device: 74HC4066PW; PackageDescription: SOP, 14-Leads, Body 4.4x5mm (max), Pitch 0.65mm, IPC Medium Density; Manufacturer Part Number: 74HC4066PW; Pin Count: 14; Case: TSSOP14; Mounted: Yes; Socket: No; SMD: Yes; Sense: No; ComponentHeight: 1.1mm; Author: CERN DEM JLC; HelpURL: \\cern.ch\dfs\Applications\Altium\Datasheets\74HC4066PW.pdf; CreateDate: 19.11.2014; LatestRevisionDate: 19.11.2014
IC32 = 74HC4066PW: Part Description: Quad Single-Pole Single-Throw Analog Switch; Manufacturer: NXP SEMICONDUCTORS; PressFit: No; Bonding: No; Table: Standard Logic; Part Number: 74HC4066PW; Component Kind: Standard; Component Type: Standard; Device: 74HC4066PW; PackageDescription: SOP, 14-Leads, Body 4.4x5mm (max), Pitch 0.65mm, IPC Medium Density; Manufacturer Part Number: 74HC4066PW; Pin Count: 14; Case: TSSOP14; Mounted: Yes; Socket: No; SMD: Yes; ComponentHeight: 1.1mm; Author: CERN DEM JLC; HelpURL: \\cern.ch\dfs\Applications\Altium\Datasheets\74HC4066PW.pdf; CreateDate: 2014-11-19; LatestRevisionDate: 2014-11-19
IC33 = TLC555ID: LinCMOS Timer; Manufacturer: TEXAS INSTRUMENTS; PressFit: No; Bonding: No; Part Number: TLC555ID; Component Kind: Standard; Component Type: Standard; Device: TLC555ID; PackageDescription: SOIC 8, Pitch 1.27mm, Body 4x5mm, IPC Medium Density; Part Description: LinCMOS Timer; Manufacturer Part Number: TLC555ID; Pin Count: 8; Case: SOIC8; Mounted: Yes; Socket: No; SMD: Yes; Sense: No; ComponentHeight: 1.75mm; Author: CERN DEM JMW; HelpURL: \\cern.ch\dfs\Applications\Altium\Datasheets\TLC555ID.pdf; CreateDate: 23.08.2016; LatestRevisionDate: 23.08.2016
J6 = AMPHENOL_10052825-101LF: 72 Contacts Header, 6 Columns, 4 Pairs per Column; Part Description: 72 Contacts, 2mm Pitch, 6 Columns, 4 Pairs per Column, 4 Walls, Right Angle Header; Part Number: AMPHENOL_10052825-101LF; Component Kind: Standard; Component Type: Standard; Pin Count: 72; Family: AirMax VS; Mounted: Yes; Socket: No; SMD: No; PressFit: Yes; Sense: No; Status: None; Manufacturer: AMPHENOL; Manufacturer Part Number: 10052825-101LF; ComponentHeight: 15.35mm; HelpURL: \\cern.ch\dfs\Applications\Altium\Datasheets\AMPHENOL_10052825-101LF.pdf; ComponentLink1URL: \\cern.ch\dfs\Applications\Altium\Datasheets\AMPHENOL_10052825-101LF_Application.pdf; ComponentLink1Description: Application; Author: CERN DEM MR; CreateDate: 19/02/2018; LatestRevisionDate: 19/02/2018; Classname: Overlapping
R50 = R0402_200R_1%_0.0625W_100PPM: Resistor - 1%; Part Description: General Purpose Thick Film Chip Resistor; Manufacturer: GENERIC; Manufacturer1 Part Number: 232270672001L; TC: ±100ppm/°C; PressFit: No; Part Number: R0402_200R_1%_0.0625W_100PPM; Component Kind: Standard; Component Type: Standard; Pin Count: 2; Value: 200; Status: Not Recommended; Power: 0.0625W; Tolerance: ±1%; Manufacturer Part Number: R0402_200R_1%_0.0625W_100PPM; Case: 0402; Mounted: Yes; Sense: No; Socket: No; SMD: Yes; Manufacturer1 Example: YAGEO PHYCOMP; Manufacturer1 ComponentHeight: 0.4mm; HelpURL: \\cern.ch\dfs\Applications\Altium\Datasheets\R0402_Phycomp_RC0402.pdf; Author: CERN DEM JLC; CreateDate: 2007-12-03; LatestRevisionDate: 2012-10-17
R51-R55 = R0402_22R_1%_0.0625W_100PPM: Resistor - 1%; Part Description: General Purpose Thick Film Chip Resistor; Manufacturer: GENERIC; Manufacturer1 Part Number: 232270672209L; TC: ±100ppm/°C; PressFit: No; Part Number: R0402_22R_1%_0.0625W_100PPM; Component Kind: Standard; Component Type: Standard; Pin Count: 2; Value: 22; Status: Not Recommended; Power: 0.0625W; Tolerance: ±1%; Manufacturer Part Number: R0402_22R_1%_0.0625W_100PPM; Case: 0402; Mounted: Yes; Socket: No; SMD: Yes; Manufacturer1 Example: YAGEO PHYCOMP; Manufacturer1 ComponentHeight: 0.4mm; HelpURL: \\cern.ch\dfs\Applications\Altium\Datasheets\R0402_Phycomp_RC0402.pdf; Author: CERN DEM JLC; CreateDate: 03.12.2007; LatestRevisionDate: 17.10.2012; Sense: No
R65 = R0402_22R_1%_0.0625W_100PPM: Resistor - 1%; Part Description: General Purpose Thick Film Chip Resistor; Manufacturer: GENERIC; Manufacturer1 Part Number: 232270672209L; PressFit: No; Part Number: R0402_22R_1%_0.0625W_100PPM; Component Kind: Standard; Component Type: Standard; Pin Count: 2; Value: 22; Status: Not Recommended; Power: 0.0625W; Tolerance: ±1%; Manufacturer Part Number: R0402_22R_1%_0.0625W_100PPM; Case: 0402; Mounted: Yes; Socket: No; SMD: Yes; Manufacturer1 Example: YAGEO PHYCOMP; Manufacturer1 ComponentHeight: 0.4mm; HelpURL: \\cern.ch\dfs\Applications\Altium\Datasheets\R0402_Phycomp_RC0402.pdf; Author: CERN DEM JLC; CreateDate: 03.12.2007; LatestRevisionDate: 17.10.2012; Sense: No
R137 = R0402_10k_1%_0.0625W_100PPM: Resistor - 1%; Part Description: General Purpose Thick Film Chip Resistor; Manufacturer: GENERIC; Manufacturer1 Part Number: 232270671003L; TC: ±100ppm/°C; PressFit: No; Part Number: R0402_10K_1%_0.0625W_100PPM; Component Kind: Standard; Component Type: Standard; Pin Count: 2; Value: 10k; Status: Not Recommended; Power: 0.0625W; Manufacturer Part Number: R0402_10K_1%_0.0625W_100PPM; Case: 0402; Mounted: Yes; Sense: No; Socket: No; SMD: Yes; Manufacturer1 Example: YAGEO PHYCOMP; Manufacturer1 ComponentHeight: 0.4mm; HelpURL: \\cern.ch\dfs\Applications\Altium\Datasheets\R0402_Phycomp_RC0402.pdf; Author: CERN DEM JLC; CreateDate: 2007-12-03; LatestRevisionDate: 2012-10-17
R138 = R0603_2K7_1%_0.1W_100PPM: Resistor - 1%; Part Description: General Purpose Thick Film Chip Resistor; Manufacturer: GENERIC; Manufacturer1 Part Number: RC0603FR-072K7L; Power: 0.1W; TC: ±100ppm/°C; PressFit: No; Part Number: R0603_2K7_1%_0.1W_100PPM; Component Kind: Standard; Component Type: Standard; Pin Count: 2; Value: 2k7; Status: Preferred; Manufacturer Part Number: R0603_2K7_1%_0.1W_100PPM; Case: 0603; Mounted: Yes; Sense: No; Socket: No; SMD: Yes; Manufacturer1 Example: YAGEO PHYCOMP; Manufacturer1 ComponentHeight: 0.55mm; HelpURL: \\cern.ch\dfs\Applications\Altium\Datasheets\R0603_PHYCOMP_RC0603.pdf; Author: CERN DEM JLC; CreateDate: 2011-05-02; LatestRevisionDate: 2011-05-02
R139 = R0402_5K6_1%_0.0625W_100PPM: Resistor - 1%; Part Description: General Purpose Thick Film Chip Resistor; Manufacturer: GENERIC; Manufacturer1 Part Number: 232270675602L; TC: ±100ppm/°C; PressFit: No; Part Number: R0402_5K6_1%_0.0625W_100PPM; Component Kind: Standard; Component Type: Standard; Pin Count: 2; Value: 5k6; Status: Not Recommended; Power: 0.0625W; Manufacturer Part Number: R0402_5K6_1%_0.0625W_100PPM; Case: 0402; Mounted: Yes; Sense: No; Socket: No; SMD: Yes; Manufacturer1 Example: YAGEO PHYCOMP; Manufacturer1 ComponentHeight: 0.4mm; HelpURL: \\cern.ch\dfs\Applications\Altium\Datasheets\R0402_Phycomp_RC0402.pdf; Author: CERN DEM JLC; CreateDate: 2007-12-03; LatestRevisionDate: 2012-10-17
R140 R141 = R0402_1k_1%_0.0625W_100PPM: Resistor - 1%; Part Description: General Purpose Thick Film Chip Resistor; Manufacturer: GENERIC; Manufacturer1 Part Number: 232270671002L; PressFit: No; Part Number: R0402_1K_1%_0.0625W_100PPM; Component Kind: Standard; Component Type: Standard; Pin Count: 2; Value: 10k; Status: Not Recommended; Power: 0.0625W; Tolerance: ±1%; Manufacturer Part Number: R0402_1K_1%_0.0625W_100PPM; Case: 0402; Mounted: Yes; Sense: No; Socket: No; SMD: Yes; Manufacturer1 Example: YAGEO PHYCOMP; Manufacturer1 ComponentHeight: 0.4mm; HelpURL: \\cern.ch\dfs\Applications\Altium\Datasheets\R0402_Phycomp_RC0402.pdf; Author: CERN DEM JLC; CreateDate: 03.12.2007; LatestRevisionDate: 17.10.2012
R142 R143 = R0402_1K6_1%_0.0625W_100PPM: Resistor - 1%; Part Description: General Purpose Thick Film Chip Resistor; Manufacturer: GENERIC; Manufacturer1 Part Number: 232270671602L; TC: ±100ppm/°C; PressFit: No; Part Number: R0402_1K6_1%_0.0625W_100PPM; Component Kind: Standard; Component Type: Standard; Pin Count: 2; Value: 1k6; Status: Not Recommended; Power: 0.0625W; Manufacturer Part Number: R0402_1K6_1%_0.0625W_100PPM; Case: 0402; Mounted: Yes; Sense: No; Socket: No; SMD: Yes; Manufacturer1 Example: YAGEO PHYCOMP; Manufacturer1 ComponentHeight: 0.4mm; HelpURL: \\cern.ch\dfs\Applications\Altium\Datasheets\R0402_Phycomp_RC0402.pdf; Author: CERN DEM JLC; CreateDate: 2007-12-03; LatestRevisionDate: 2012-10-17
R144 R145 = R0402_0R_JUMPER: Resistor; Part Description: 1A (0.05R Max DC Resistance) Zero Ohm Jumper; Manufacturer: GENERIC; Manufacturer1 Part Number: 232270591001L; Part Number: R0402_0R_JUMPER; Component Kind: Standard; Component Type: Standard; Pin Count: 2; Value: 0; Status: Not recommended; Manufacturer Part Number: R0402_0R_JUMPER; Case: 0402; Mounted: Yes; Sense: No; Socket: No; SMD: Yes; Manufacturer1 Example: YAGEO PHYCOMP; Manufacturer1 ComponentHeight: 0.4mm; HelpURL: \\cern.ch\dfs\Applications\Altium\Datasheets\R0402_Phycomp_RC0402.pdf; Author: CERN DEM JLC; CreateDate: 03.12.2007; LatestRevisionDate: 17.10.2012
R146 R147 = R0402_10K_1%_0.0625W_100PPM: as R131 on sheet Supply_HV_ISOL; Part Number: R0402_10K_1%_0.0625W_100PPM; Component Kind: Standard; Component Type: Standard; Pin Count: 2; Value: 10k; Status: Not Recommended; Power: 0.0625W; Tolerance: ±1%; Manufacturer Part Number: R0402_10K_1%_0.0625W_100PPM; Case: 0402; Mounted: Yes; Sense: No; Socket: No; SMD: Yes; Manufacturer1 Example: YAGEO PHYCOMP; Manufacturer1 ComponentHeight: 0.4mm; HelpURL: \\cern.ch\dfs\Applications\Altium\Datasheets\R0402_Phycomp_RC0402.pdf; Author: CERN DEM JLC; CreateDate: 2007-12-03; LatestRevisionDate: 2012-10-17
T13 = BSH103: N-CHANNEL MOSFET WITH DIODE; Part Description: 30V 850mA N-Channel Enhancement Mode Field-Effect Transistor; Manufacturer: NEXPERIA; PressFit: No; Bonding: No; Part Number: BSH103; Component Kind: Standard; Component Type: Standard; Device: BSH103; PackageDescription: SOT23, 0.95mm Pitch; 3 Pin, 1.30mm W X 2.90mm L X 1.10mm H body, IPC Medium Density; Manufacturer Part Number: BSH103; Pin Count: 3; Case: SOT23-3; Mounted: Yes; Socket: No; SMD: Yes; Sense: No; ComponentHeight: 1.1mm; HelpURL: \\cern.ch\dfs\Applications\Altium\Datasheets\BSH103.pdf; Author: CERN DEM JLC; CreateDate: 16.03.2010; LatestRevisionDate: 20.06.2017

## Nets that join several sheets
GND: HV_Module_6W (5 pins), Isolators_HV_6W (30 pins), Supply_12V_ISOL (C4.1 L2.2), HVSUP_ISOL_Mainboard (34 pins), EEM_connector (28 pins), Supply_HV_ISOL (27 pins), DIOT_Connectors (35 pins)
GNDp: HV_Module_6W (5 pins), Isolators_HV_6W (23 pins), U_HV_Module/U_ADC_DAC1 (16 pins), U_HV_Module/U_HV_PWR_STAGE1 (33 pins), Supply_12V_ISOL (24 pins), U_HV_Module/U_ADC_DAC2 (16 pins), U_HV_Module/U_HV_PWR_STAGE2 (33 pins), LED_indicators_6W (6 pins)
N3V3p: U_HV_Module/U_HV_PWR_STAGE1 (6 pins), Supply_12V_ISOL (C67.2 IC2.5 IC38.5), U_HV_Module/U_HV_PWR_STAGE2 (6 pins)
P3V3: HV_Module_6W (J1.11), Isolators_HV_6W (15 pins), HVSUP_ISOL_Mainboard (10 pins), EEM_connector (10 pins), Supply_HV_ISOL (12 pins)
P3V3_CPCIS: Supply_HV_ISOL (C107.2 C108.2 D13.2 IC37.5), DIOT_Connectors (10 pins)
P3V3_MP: HVSUP_ISOL_Mainboard (7 pins), EEM_connector (9 pins), Supply_HV_ISOL (D7.1 D13.1)
P3V3Ap: U_HV_Module/U_ADC_DAC1 (C19A.2 C24A.2 IC15A.38), U_HV_Module/U_HV_PWR_STAGE1 (R175A.2), Supply_12V_ISOL (C57.2 L7.2), U_HV_Module/U_ADC_DAC2 (C19B.2 C24B.2 IC15B.38), U_HV_Module/U_HV_PWR_STAGE2 (R175B.2)
P3V3p: Isolators_HV_6W (16 pins), Supply_12V_ISOL (7 pins)
P5V0Ap: HV_Module_6W (C53.1 C54.2 IC21.2), U_HV_Module/U_HV_PWR_STAGE1 (10 pins), Supply_12V_ISOL (5 pins), U_HV_Module/U_HV_PWR_STAGE2 (10 pins), LED_indicators_6W (10 pins)
P12V0: HV_Module_6W (J1.6 J1.8 J1.10), Supply_12V_ISOL (C4.2 L2.1), EEM_connector (J2.28 J2.29 R149.1), Supply_HV_ISOL (19 pins)
P12V0_CPCIS: EEM_connector (R149.2), Supply_HV_ISOL (C106.2 IC37.1 IC37.3), DIOT_Connectors (7 pins)
P12V0_SW: HVSUP_ISOL_Mainboard (J5.6 J5.8 J5.10), Supply_HV_ISOL (T1.5 T1.6 T1.7 T1.8)
P12V0p: U_HV_Module/U_HV_PWR_STAGE1 (C70A.1 R163A.2 R164A.1 T15A.2), Supply_12V_ISOL (10 pins), U_HV_Module/U_HV_PWR_STAGE2 (C70B.1 R163B.2 R164B.1 T15B.2)
BP_IO.LVDS_N0: EEM_connector (R34.2), DIOT_Connectors (J6.E3)
BP_IO.LVDS_N1: EEM_connector (R36.2), DIOT_Connectors (J6.B3)
BP_IO.LVDS_N2: EEM_connector (R38.2), DIOT_Connectors (J6.C4)
BP_IO.LVDS_N3: EEM_connector (R40.2), DIOT_Connectors (J6.L4)
BP_IO.LVDS_N4: EEM_connector (R42.2), DIOT_Connectors (J6.I4)
BP_IO.LVDS_N5: EEM_connector (R44.2), DIOT_Connectors (J6.K5)
BP_IO.LVDS_N6: EEM_connector (R46.2), DIOT_Connectors (J6.H5)
BP_IO.LVDS_N7: EEM_connector (R48.2), DIOT_Connectors (J6.F6)
BP_IO.LVDS_P0: EEM_connector (R31.2), DIOT_Connectors (J6.D3)
BP_IO.LVDS_P1: EEM_connector (R35.2), DIOT_Connectors (J6.A3)
BP_IO.LVDS_P2: EEM_connector (R37.2), DIOT_Connectors (J6.B4)
BP_IO.LVDS_P3: EEM_connector (R39.2), DIOT_Connectors (J6.K4)
BP_IO.LVDS_P4: EEM_connector (R41.2), DIOT_Connectors (J6.H4)
BP_IO.LVDS_P5: EEM_connector (R43.2), DIOT_Connectors (J6.J5)
BP_IO.LVDS_P6: EEM_connector (R45.2), DIOT_Connectors (J6.G5)
BP_IO.LVDS_P7: EEM_connector (R47.2), DIOT_Connectors (J6.E6)
CSN: HV_Module_6W (J1.5), Isolators_HV_6W (R99.2)
CSN: HVSUP_ISOL_Mainboard (J5.5), EEM_connector (R13.1)
ENBLn1: U_HV_Module/U_ADC_DAC1 (IC15A.1), U_HV_Module/U_HV_PWR_STAGE1 (IC11A.1 R175A.1)
ENBLn2: U_HV_Module/U_ADC_DAC2 (IC15B.1), U_HV_Module/U_HV_PWR_STAGE2 (IC11B.1 R175B.1)
HV_EN: HV_Module_6W (J1.15), Isolators_HV_6W (IC28.1)
HV_EN: HVSUP_ISOL_Mainboard (J5.15 R111.2), EEM_connector (R15.1)
HV_INTERLOCK: HVSUP_ISOL_Mainboard (R116.2 T9.1), EEM_connector (R19.1)
I2C_SCL: HVSUP_ISOL_Mainboard (R128.1), EEM_connector (7 pins)
I2C_SCL.CPCIS: EEM_connector (R151.2), DIOT_Connectors (IC12.9 IC12.10)
I2C_SDA: HVSUP_ISOL_Mainboard (R126.1), EEM_connector (7 pins)
I2C_SDA.CPCIS: EEM_connector (R150.2), DIOT_Connectors (IC12.2 IC12.3)
INT0: HV_Module_6W (J1.9), Isolators_HV_6W (IC28.4)
INT0: HVSUP_ISOL_Mainboard (J5.9 T3.1), EEM_connector (R18.1)
NetC134A_2: U_HV_Module/U_ADC_DAC1 (IC15A.30), U_HV_Module/U_HV_PWR_STAGE1 (C134A.2 R94A.1)
NetC134B_2: U_HV_Module/U_ADC_DAC2 (IC15B.30), U_HV_Module/U_HV_PWR_STAGE2 (C134B.2 R94B.1)
NetIC1_8: Isolators_HV_6W (IC1.8), U_HV_Module/U_ADC_DAC1 (IC15A.7)
NetIC11A_2: Isolators_HV_6W (IC27.2), U_HV_Module/U_HV_PWR_STAGE1 (IC11A.2 R172A.2), U_HV_Module/U_HV_PWR_STAGE2 (IC11B.2 R172B.2)
NetIC15A_5: Isolators_HV_6W (R103.2), U_HV_Module/U_ADC_DAC1 (IC15A.5)
NetIC15A_6: Isolators_HV_6W (IC23.8), U_HV_Module/U_ADC_DAC1 (IC15A.6)
NetIC15A_8: Isolators_HV_6W (IC24.8), U_HV_Module/U_ADC_DAC1 (IC15A.8)
NetIC15A_11: U_HV_Module/U_ADC_DAC1 (IC15A.11), U_HV_Module/U_ADC_DAC2 (IC15B.5)
NetIC15A_12: U_HV_Module/U_ADC_DAC1 (IC15A.12), U_HV_Module/U_ADC_DAC2 (IC15B.7)
NetIC15A_13: U_HV_Module/U_ADC_DAC1 (IC15A.13), U_HV_Module/U_ADC_DAC2 (IC15B.6)
NetIC15A_14: U_HV_Module/U_ADC_DAC1 (IC15A.14), U_HV_Module/U_ADC_DAC2 (IC15B.8)
NetIC15A_23: U_HV_Module/U_ADC_DAC1 (IC15A.23 R27A.2), U_HV_Module/U_HV_PWR_STAGE1 (R93A.2)
NetIC15A_24: U_HV_Module/U_ADC_DAC1 (IC15A.24 R25A.2), U_HV_Module/U_HV_PWR_STAGE1 (R78A.2)
NetIC15B_23: U_HV_Module/U_ADC_DAC2 (IC15B.23 R27B.2), U_HV_Module/U_HV_PWR_STAGE2 (R93B.2)
NetIC15B_24: U_HV_Module/U_ADC_DAC2 (IC15B.24 R25B.2), U_HV_Module/U_HV_PWR_STAGE2 (R78B.2)
NetIC27_3: Isolators_HV_6W (IC27.3 R107.1), U_HV_Module/U_ADC_DAC1 (T12A.3), U_HV_Module/U_ADC_DAC2 (T12B.3)
NetJ4_1: HV_Module_6W (J4.1), U_HV_Module/U_HV_PWR_STAGE2 (R76B.2 R170B.2)
NetJ7_1: HV_Module_6W (J7.1), U_HV_Module/U_HV_PWR_STAGE1 (R76A.2 R170A.2)
PSU_EN: HVSUP_ISOL_Mainboard (T4.1 T14.3), EEM_connector (R17.1), Supply_HV_ISOL (T2.1), DIOT_Connectors (R144.1)
REFIN: HV_Module_6W (C55.2 IC21.6), U_HV_Module/U_ADC_DAC1 (R20A.2 R22A.2), U_HV_Module/U_ADC_DAC2 (R20B.2 R22B.2)
SCKI: HV_Module_6W (J1.7), Isolators_HV_6W (R95.2)
SCKI: HVSUP_ISOL_Mainboard (J5.7), EEM_connector (R10.1)
SDI: HV_Module_6W (J1.1), Isolators_HV_6W (R2.2)
SDI: HVSUP_ISOL_Mainboard (J5.1), EEM_connector (R161.1)
SDO: HV_Module_6W (J1.3), Isolators_HV_6W (IC25.8)
SDO: HVSUP_ISOL_Mainboard (J5.3), EEM_connector (R11.1)
U_meas1: U_HV_Module/U_ADC_DAC1 (IC15A.31), U_HV_Module/U_HV_PWR_STAGE1 (C128A.2 R80A.1), LED_indicators_6W (C44.2)
U_meas2: U_HV_Module/U_ADC_DAC2 (IC15B.31), U_HV_Module/U_HV_PWR_STAGE2 (C128B.2 R80B.1), LED_indicators_6W (C46.2)

## Assembly variants
DIOT_HVP_HVN: not fitted D3B D8B D9B D13B D14B D15B D16B D25B IC36 R5A R7B R30A R49A R63B R80B R89A R180B; alternate parts IC9B -> DCDC_AG20N-5